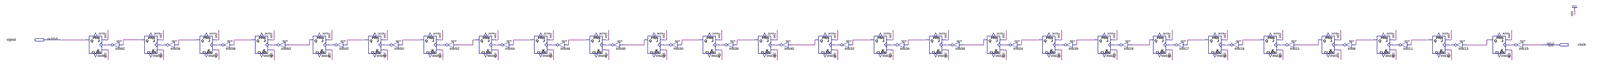
[diagram p0: schematic sheet, whole]
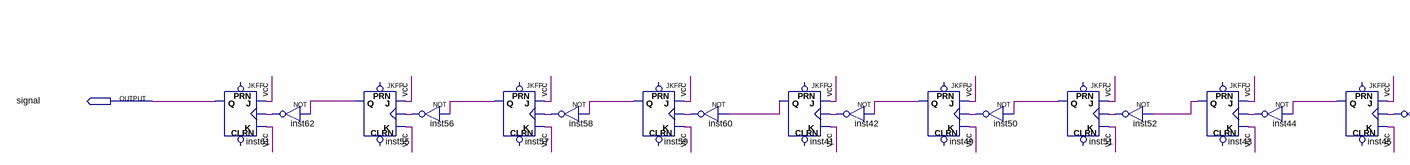
[diagram p1: schematic sheet, left part]
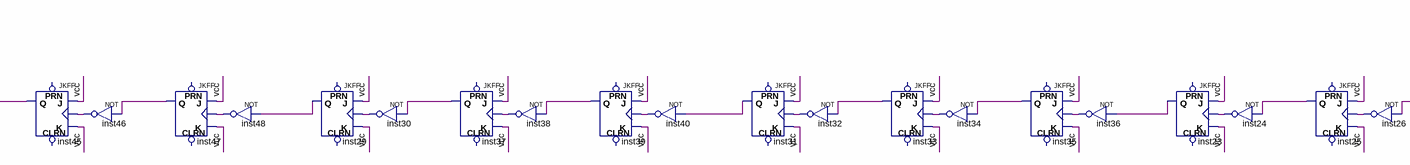
[diagram p2: schematic sheet, centre part]
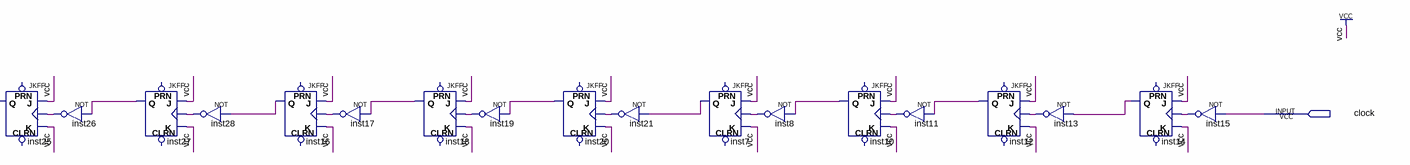
[diagram p3: schematic sheet, right part]
// Quartus schematic frequency_divider.bdf as structural Verilog: 52 symbols, 2 pins
module frequency_divider (
  input  clock,
  output signal
);

  wire inst7_q, inst8_out, inst10_q, inst11_out, inst12_q, inst13_out, inst14_q, inst15_out, inst16_q,
       inst17_out, inst18_q, inst19_out, inst20_q, inst21_out, inst23_q, inst24_out, inst25_q, inst26_out,
       inst27_q, inst28_out, inst29_q, inst30_out, inst31_q, inst32_out, inst33_q, inst34_out, inst35_q,
       inst36_out, inst37_q, inst38_out, inst39_q, inst40_out, inst41_q, inst42_out, inst43_q, inst44_out,
       inst45_q, inst46_out, inst47_q, inst48_out, inst49_q, inst50_out, inst51_q, inst52_out, inst55_q,
       inst56_out, inst57_q, inst58_out, inst59_q, inst60_out, inst62_out;

  JKFF inst61 (.K(1'b1), .J(1'b1), .CLK(inst62_out), .Q(signal));  // open: PRN, CLRN
  not inst62 (inst62_out, inst55_q);
  JKFF inst55 (.K(1'b1), .J(1'b1), .CLK(inst56_out), .Q(inst55_q));  // open: PRN, CLRN
  not inst56 (inst56_out, inst57_q);
  JKFF inst57 (.K(1'b1), .J(1'b1), .CLK(inst58_out), .Q(inst57_q));  // open: PRN, CLRN
  not inst58 (inst58_out, inst59_q);
  JKFF inst59 (.K(1'b1), .J(1'b1), .CLK(inst60_out), .Q(inst59_q));  // open: PRN, CLRN
  not inst60 (inst60_out, inst41_q);
  JKFF inst41 (.K(1'b1), .J(1'b1), .CLK(inst42_out), .Q(inst41_q));  // open: PRN, CLRN
  not inst42 (inst42_out, inst49_q);
  JKFF inst49 (.K(1'b1), .J(1'b1), .CLK(inst50_out), .Q(inst49_q));  // open: PRN, CLRN
  not inst50 (inst50_out, inst51_q);
  JKFF inst51 (.K(1'b1), .J(1'b1), .CLK(inst52_out), .Q(inst51_q));  // open: PRN, CLRN
  not inst52 (inst52_out, inst43_q);
  JKFF inst43 (.K(1'b1), .J(1'b1), .CLK(inst44_out), .Q(inst43_q));  // open: PRN, CLRN
  not inst44 (inst44_out, inst45_q);
  JKFF inst45 (.K(1'b1), .J(1'b1), .CLK(inst46_out), .Q(inst45_q));  // open: PRN, CLRN
  not inst46 (inst46_out, inst47_q);
  JKFF inst47 (.K(1'b1), .J(1'b1), .CLK(inst48_out), .Q(inst47_q));  // open: PRN, CLRN
  not inst48 (inst48_out, inst29_q);
  JKFF inst29 (.K(1'b1), .J(1'b1), .CLK(inst30_out), .Q(inst29_q));  // open: PRN, CLRN
  not inst30 (inst30_out, inst37_q);
  JKFF inst37 (.K(1'b1), .J(1'b1), .CLK(inst38_out), .Q(inst37_q));  // open: PRN, CLRN
  not inst38 (inst38_out, inst39_q);
  JKFF inst39 (.K(1'b1), .J(1'b1), .CLK(inst40_out), .Q(inst39_q));  // open: PRN, CLRN
  not inst40 (inst40_out, inst31_q);
  JKFF inst31 (.K(1'b1), .J(1'b1), .CLK(inst32_out), .Q(inst31_q));  // open: PRN, CLRN
  not inst32 (inst32_out, inst33_q);
  JKFF inst33 (.K(1'b1), .J(1'b1), .CLK(inst34_out), .Q(inst33_q));  // open: PRN, CLRN
  not inst34 (inst34_out, inst35_q);
  JKFF inst35 (.K(1'b1), .J(1'b1), .CLK(inst36_out), .Q(inst35_q));  // open: PRN, CLRN
  not inst36 (inst36_out, inst23_q);
  JKFF inst23 (.K(1'b1), .J(1'b1), .CLK(inst24_out), .Q(inst23_q));  // open: PRN, CLRN
  not inst24 (inst24_out, inst25_q);
  JKFF inst25 (.K(1'b1), .J(1'b1), .CLK(inst26_out), .Q(inst25_q));  // open: PRN, CLRN
  not inst26 (inst26_out, inst27_q);
  JKFF inst27 (.K(1'b1), .J(1'b1), .CLK(inst28_out), .Q(inst27_q));  // open: PRN, CLRN
  not inst28 (inst28_out, inst16_q);
  JKFF inst16 (.K(1'b1), .J(1'b1), .CLK(inst17_out), .Q(inst16_q));  // open: PRN, CLRN
  not inst17 (inst17_out, inst18_q);
  JKFF inst18 (.K(1'b1), .J(1'b1), .CLK(inst19_out), .Q(inst18_q));  // open: PRN, CLRN
  not inst19 (inst19_out, inst20_q);
  JKFF inst20 (.K(1'b1), .J(1'b1), .CLK(inst21_out), .Q(inst20_q));  // open: PRN, CLRN
  not inst21 (inst21_out, inst7_q);
  JKFF inst7 (.K(1'b1), .J(1'b1), .CLK(inst8_out), .Q(inst7_q));  // open: PRN, CLRN
  not inst8 (inst8_out, inst10_q);
  JKFF inst10 (.K(1'b1), .J(1'b1), .CLK(inst11_out), .Q(inst10_q));  // open: PRN, CLRN
  not inst11 (inst11_out, inst12_q);
  JKFF inst12 (.K(1'b1), .J(1'b1), .CLK(inst13_out), .Q(inst12_q));  // open: PRN, CLRN
  not inst13 (inst13_out, inst14_q);
  JKFF inst14 (.K(1'b1), .J(1'b1), .CLK(inst15_out), .Q(inst14_q));  // open: PRN, CLRN
  not inst15 (inst15_out, clock);
endmodule
